# Altium schematic sheet ALL COMPLETED COMPONENTS.SchDoc
size A; SheetNumber: 1; SheetTotal: 1
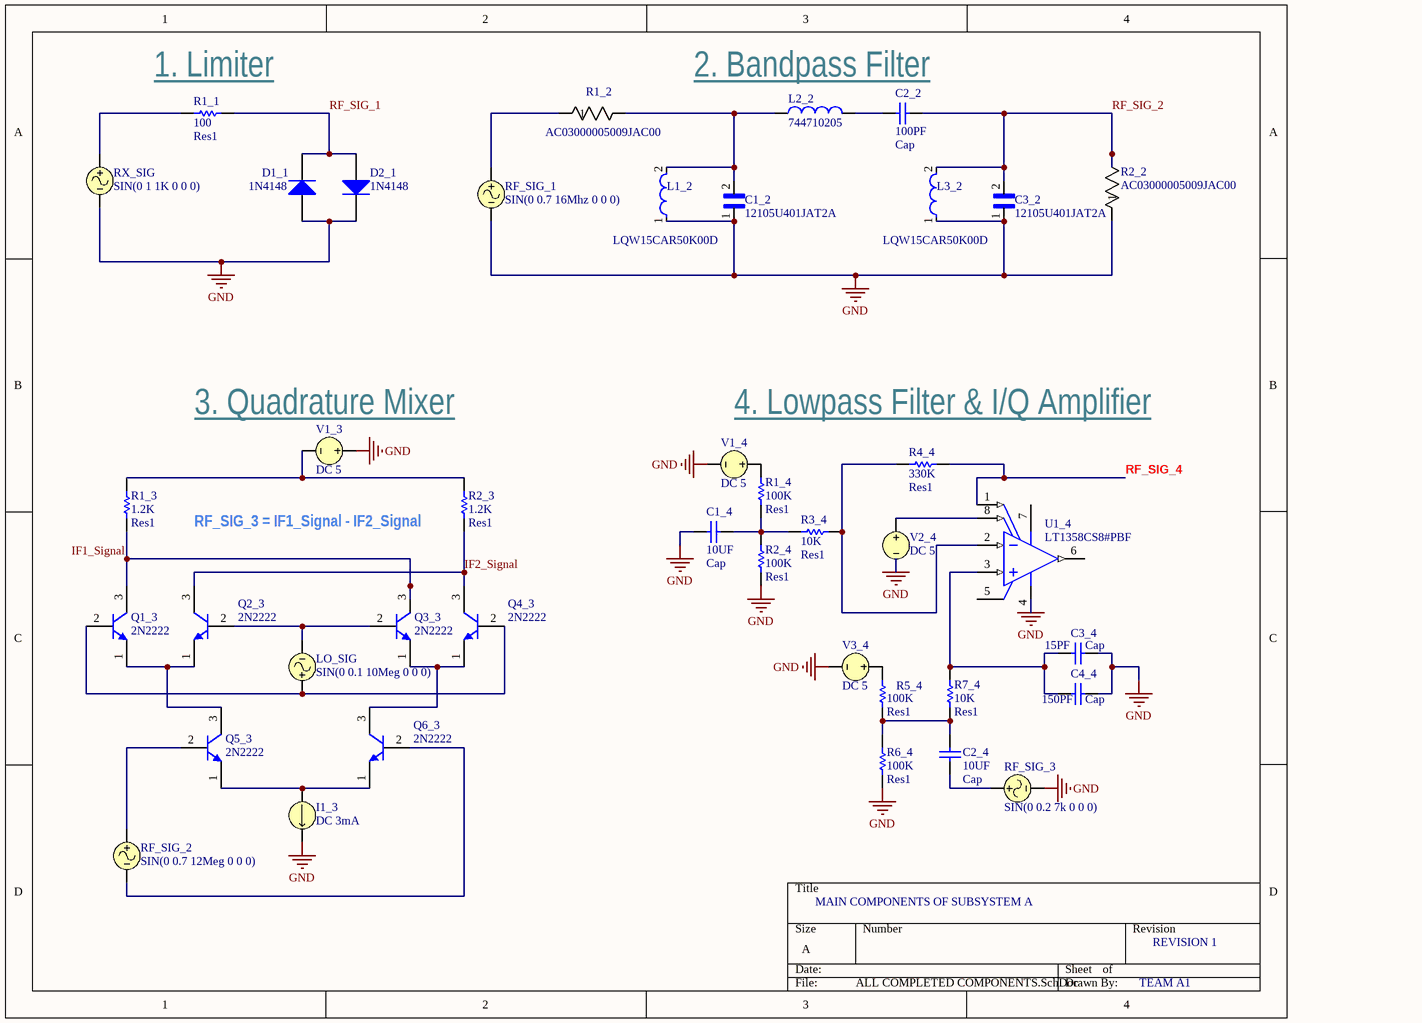
[diagram p0: ALL COMPLETED COMPONENTS.SchDoc]

## Parts
C1_2  12105U401JAT2A  [CAPC3224X140N]
C1_4  Cap  value 10UF  [RADIAL-0.1]
C2_2  Cap  value 100PF  [RADIAL-0.1]
C2_4  Cap  value 10UF  [RADIAL-0.1]
C3_2  12105U401JAT2A  [CAPC3224X140N]
C3_4  Cap  value 15PF  [RADIAL-0.1]
C4_4  Cap  value 150PF  [RADIAL-0.1]
D1_1  1N4148  [NXP-SOD27-2_V]
D2_1  1N4148  [NXP-SOD27-2_V]
I1_3  DC 3mA
L1_2  LQW15CAR50K00D  [FP-LQW15CA_00-MFG]
L2_2  744710205  [744710205]
L3_2  LQW15CAR50K00D  [FP-LQW15CA_00-MFG]
LO_SIG  SIN(0 0.1 10Meg 0 0 0)
Q1_3  2N2222  [MLTC-TO-18-3]
Q2_3  2N2222  [MLTC-TO-18-3]
Q3_3  2N2222  [MLTC-TO-18-3]
Q4_3  2N2222  [MLTC-TO-18-3]
Q5_3  2N2222  [MLTC-TO-18-3]
Q6_3  2N2222  [MLTC-TO-18-3]
R1_1  Res1  value 100  [AXIAL-0.1-RES]
R1_2  AC03000005009JAC00  [RES_AC03_VIS]
R1_3  Res1  value 1.2K  [AXIAL-0.1-RES]
R1_4  Res1  value 100K  [AXIAL-0.1-RES]
R2_2  AC03000005009JAC00  [RES_AC03_VIS]
R2_3  Res1  value 1.2K  [AXIAL-0.1-RES]
R2_4  Res1  value 100K  [AXIAL-0.1-RES]
R3_4  Res1  value 10K  [AXIAL-0.1-RES]
R4_4  Res1  value 330K  [AXIAL-0.1-RES]
R5_4  Res1  value 100K  [AXIAL-0.1-RES]
R6_4  Res1  value 100K  [AXIAL-0.1-RES]
R7_4  Res1  value 10K  [AXIAL-0.1-RES]
RF_SIG_1  SIN(0 0.7 16Mhz 0 0 0)
RF_SIG_2  SIN(0 0.7 12Meg 0 0 0)
RF_SIG_3  SIN(0 0.2 7k 0 0 0)
RX_SIG  SIN(0 1 1K 0 0 0)
U1_4  LT1358CS8#PBF  [LT-S8-8_M]
V1_3  DC 5
V1_4  DC 5
V2_4  DC 5
V3_4  DC 5

## Nets
GND: C1_2.1 C1_4.1 C3_2.1 C3_4.2 C4_4.1 D1_1.1(A) D2_1.2(K) I1_3.2 L1_2.1 L3_2.1 R2_2.1 R2_4.1 R6_4.1 RF_SIG_1.2 RF_SIG_3.2 RX_SIG.2 U1_4.4(V-) V1_3.1 V1_4.2 V2_4.2 V3_4.2
IF1_Signal: Q1_3.3(C) Q3_3.3(C) R1_3.1
IF2_Signal: Q2_3.3(C) Q4_3.3(C) R2_3.1
RF_SIG_1: D1_1.2(K) D2_1.1(A) R1_1.2
RF_SIG_2: C2_2.2 C3_2.2 L3_2.2 R2_2.2
RF_SIG_4: R4_4.2 U1_4.1(NULL)
NetC1_2_2: C1_2.2 L1_2.2 L2_2.1 R1_2.2
NetC1_4_2: C1_4.2 R1_4.1 R2_4.2 R3_4.1
NetC2_2_1: C2_2.1 L2_2.2
NetC2_4_1: C2_4.1 RF_SIG_3.1
NetC2_4_2: C2_4.2 R5_4.1 R6_4.2 R7_4.1
NetC3_4_1: C3_4.1 C4_4.2 R7_4.2 U1_4.3(+IN)
NetI1_3_1: I1_3.1 Q5_3.1(E) Q6_3.1(E)
NetLO_SIG_1: LO_SIG.1 Q1_3.2(B) Q4_3.2(B)
NetLO_SIG_2: LO_SIG.2 Q2_3.2(B) Q3_3.2(B)
NetQ1_3_1: Q1_3.1(E) Q2_3.1(E) Q5_3.3(C)
NetQ3_3_1: Q3_3.1(E) Q4_3.1(E) Q6_3.3(C)
NetQ5_3_2: Q5_3.2(B) RF_SIG_2.1
NetQ6_3_2: Q6_3.2(B) RF_SIG_2.2
NetR1_1_1: R1_1.1 RX_SIG.1
NetR1_2_1: R1_2.1 RF_SIG_1.1
NetR1_3_2: R1_3.2 R2_3.2 V1_3.2
NetR1_4_2: R1_4.2 V1_4.1
NetR3_4_2: R3_4.2 R4_4.1 U1_4.2(-IN)
NetR5_4_2: R5_4.2 V3_4.1
NetU1_4_8: U1_4.8(NULL) V2_4.1

Not connected (* = marked no-connect by the designer): U1_4 5(NC) 6(VOUT) 7(V+)

## Notes on the sheet
- (near R1_1) 1. Limiter
- 2. Bandpass Filter
- (near V1_3) 3. Quadrature Mixer
- 4. Lowpass Filter & I/Q Amplifier
- (near R2_3) RF_SIG_3 = IF1_Signal - IF2_Signal
- MAIN COMPONENTS OF SUBSYSTEM A
- REVISION 1
- TEAM A1

## Library data of the parts
C1_2 C3_2 = 12105U401JAT2A: CAP CER 400PF 50V 5% NP0 1210; Package: None; Price: None; Value: *; MP: 12105U401JAT2A; Availability: Unavailable
C1_4 C2_4 = CAP ALUM 10UF 20% 63V RADIAL: Capacitor; Manufacturer Part Number: ESK106M063AC3FA; Designator: C?; Voltage Rating: 63V; Published: 8-Jun-2000; LatestRevisionDate: 17-Jul-2002; LatestRevisionNote: Re-released for DXP Platform.; Publisher: Altium Limited
C2_2 = CAP CER 100PF 50V C0G/NP0 RADIAL: Capacitor; Manufacturer Part Number: K101K15C0GF53L2; Designator: C?; Voltage Rating: 50V; Published: 8-Jun-2000; LatestRevisionDate: 17-Jul-2002; LatestRevisionNote: Re-released for DXP Platform.; Publisher: Altium Limited
C3_4 = CAP CER 15PF 50V C0G/NP0 RADIAL: Capacitor; Manufacturer Part Number: K150J15C0GF5TL2; Designator: C?; Voltage Rating: 50V; Published: 8-Jun-2000; LatestRevisionDate: 17-Jul-2002; LatestRevisionNote: Re-released for DXP Platform.; Publisher: Altium Limited
C4_4 = CAP CER 150PF 50V C0G/NP0 RADIAL: Capacitor; Manufacturer Part Number: K151J15C0GF53L2; Designator: C?; Voltage Rating: 50V; Published: 8-Jun-2000; LatestRevisionDate: 17-Jul-2002; LatestRevisionNote: Re-released for DXP Platform.; Publisher: Altium Limited
D1_1 D2_1 = CMP-0648-00002-1: High-speed Diode, 100 V, 450 mA, 2-Pin SOD27, RoHS; Manufacturer: NXP Semiconductors; Configuration: Single; IR (VR: 20 V)=25 nA; IFRM: 450 mA; IFSM: 4 A Max.; Trr: 4 ns Max.; Cd: 4 pF Max.; VR: 100 V Max.; VF (IF: 10 mA)=1 V; IF: 200 mA Max.; ComponentLink1Description: Manufacturer URL; RoHS: TRUE; ComponentLink1URL: http://www.nxp.com/; ComponentLink3Description: Package Specification; DatasheetVersion: Aug-04; ComponentLink2Description: Datasheet; PackageVersion: Aug-04; PackageReference: SOD27; ComponentLink3URL: http://www.nxp.com/documents/data_sheet/1N4148_1N4448.pdf; Mounting Technology: Through Hole; ComponentLink2URL: http://www.nxp.com/documents/data_sheet/1N4148_1N4448.pdf; PartNumber: 1N4148; PackageDescription: 2-Pin Hermetically Sealed Glass Package, Axial Leaded, Dia 1.85 mm, Body Length 4.25 mm, Lead Spread 25.4 mm
I1_3 = ISRC: Current Source; Note: PCB Footprint - Not required; AC Magnitude: 0; Published: 8-Jun-2000; LatestRevisionDate: 17-Jul-2002; LatestRevisionNote: Re-released for DXP Platform.; PackageReference: Not Applicable; Publisher: Altium Limited; AC Phase: 0; Value: 3mA
L1_2 L3_2 = CMP-06042-016137-1: Wire Wound Ferrite Inductor for General Circuits 500nH ±10% 270mA 0.97Ω 0402 (1005); DC Resistance (DCR): 970mR; Test Frequency: 10MHz; Shielding: Unshielded; Self Resonant Frequency: 900MHz; RoHS Compliant: Yes; Case/Package: Nonstandard; Resistor Type: Wirewound; Height - Seated (Max): 0.026inch; Current Rating: 270mA; Width: 0.022inch; Tolerance: 10%; Min Operating Temperature: -40°C; Mount: Surface Mount; Packaging: Tape and Reel; Length: 0.04inch; Inductance: 500nH; Max Operating Temperature: 125°C; Core Material: Ferrite
L2_2 = CMP-0221-00023-2: 2 µH Unshielded Drum Core, Wirewound Inductor 5 A 6.5mOhm Radial, Horizontal Cylinder (Open); NexarPartId: 8917044; Lead Length: 9.7mm; Current Rating: 5A; Core Material: Ferrite; Frequency: 100MHz; Pin Length: 3mm; Test Frequency: 10kHz; Tolerance: 25%; Resistance: 6.5MΩ; Inductance: 2µH; RoHS: Compliant; Composition: Wirewound; Ambient Temperature Range Low: -40°C; Termination: Radial; Ambient Temperature Range High: 110°C; REACH SVHC: Unknown; Width: 9.6mm; Height: 14mm; Number of Pins: 2; Shielding: Unshielded; Length: 14mm; Lead Pitch: 9.6mm; Max Operating Temperature: 150°C; Inductance Tolerance: 25%; Mount: Through Hole; Case/Package: Radial; Max DC Current: 5A; Diameter: 4mm; Min Operating Temperature: -40°C; DC Resistance (DCR): 6.5mΩ; Self Resonant Frequency: 100MHz
LO_SIG = VSIN: Sinusoidal Voltage Source; Note: PCB Footprint - Not required; Offset: 0; Amplitude: 0.1; Published: 8-Jun-2000; LatestRevisionDate: 15-Nov-2004; LatestRevisionNote: Corrected Netlist.; PackageReference: Not Applicable; Publisher: Altium Limited; Frequency: 10Meg; Delay: 0; Damping Factor: 0; Phase: 0; DC Magnitude: 0; AC Magnitude: 0; AC Phase: 0
Q1_3 Q2_3 Q3_3 Q4_3 Q5_3 Q6_3 = CMP-2000-05237-1: Low Power Bipolar NPN Transistor, 30 V, -65 to 200 degC, 3-Pin TO-18, RoHS, Bulk; Manufacturer: Multicomp; Pin Configuration: a; No. of Pins: 3; No. of Transistors: 1; Collector Emitter Voltage Vces: 400mV; Current Ic Continuous a Max: 800mA; Power Dissipation Pd: 500mW; Collector Emitter Voltage V(br)ceo: 30V; Gain Bandwidth ft Typ: 250MHz; Voltage Vcbo: 60V; DC Current Gain hFE: 100; Full Power Rating Temperature: 25degC; Current Ic @ Vce Sat: 150mA; SVHC: NoSVHC(19-Dec-2012); Package Reference: TO-18-3; Package Description: 3-Pin Transistor Outline Package (TO-18), Dia 5.54 mm, Pitch Pitch 1.485mm; Datasheet URL: http://www.farnell.com/datasheets/1662272.pdf; Transistor Case Style: TO-18; Continuous Collector Current Ic Max: 800mA; Manufacturer URL: http://uk.farnell.com/b/multicomp; DC Collector Current: 800mA; Hfe Min: 100; Transistor Polarity: NPN; Power Dissipation Ptot Max: 500mW; Package / Case: TO-18; Datasheet Version: Rev. 1.1, 05/2012; Gain Bandwidth ft Min: 250MHz; Current Ic hFE: 150mA
R1_1 = RES 100 OHM 5% 1/4W AXIAL: Resistor; Manufacturer Part Number: CFR-25JB-52-100R; Designator: R?; Power Rating: 1/4W; Tolerance: 0.05; Published: 8-Jun-2000; LatestRevisionDate: 17-Jul-2002; LatestRevisionNote: Re-released for DXP Platform.; Publisher: Altium Limited
R1_2 R2_2 = CMP-00030-39746332-1: AC03000005009JAC00 Res Wirewound 50 Ohm 5% 3W -80ppm/°C to -10ppm/°C Conformal AXL Thru-Hole Ammo Pack; Voltage Rating: 12V; Lead Diameter: 800µm; Resistance: 50Ω; Number of Terminations: 2; Features: Flame Retardant Coating; Number of Pins: 2; Termination: Axial; Diameter: 4.8mm; Packaging: Tape & Box (TB); REACH SVHC: Unknown; Min Operating Temperature: -40°C; Contact Plating: Tin; Length: 13mm; Thickness: 4.8006mm; Power Rating: 3W; Schedule B: 8533210080, 8533210080; Temperature Coefficient: -80ppm/°C; Tolerance: 5%; RoHS: Compliant; Radiation Hardening: No; Voltage Rating (DC): 12V; Width: 4.8mm; Max Power Dissipation: 3W; Case/Package: Axial; Composition: Wirewound; Max Operating Temperature: 275°C; NexarPartId: 39746332
R1_3 R2_3 = RES 1.2K OHM 5% 1/4W AXIAL: Resistor; Manufacturer Part Number: CFR-25JB-52-1K2; Designator: R?; Power Rating: 1/4W; Tolerance: 0.05; Published: 8-Jun-2000; LatestRevisionDate: 17-Jul-2002; LatestRevisionNote: Re-released for DXP Platform.; Publisher: Altium Limited
R1_4 R2_4 R5_4 R6_4 = RES 100K OHM 5% 1/4W AXIAL: Resistor; Manufacturer Part Number: CFR-25JB-52-100K; Designator: R?; Power Rating: 1/4W; Tolerance: 0.05; Published: 8-Jun-2000; LatestRevisionDate: 17-Jul-2002; LatestRevisionNote: Re-released for DXP Platform.; Publisher: Altium Limited
R3_4 R7_4 = RES 10K OHM 5% 1/4W AXIAL: Resistor; Manufacturer Part Number: CFR-25JB-52-10K; Designator: R?; Power Rating: 1/4W; Tolerance: 0.05; Published: 8-Jun-2000; LatestRevisionDate: 17-Jul-2002; LatestRevisionNote: Re-released for DXP Platform.; Publisher: Altium Limited
R4_4 = RES 330K OHM 5% 1/4W AXIAL: Resistor; Manufacturer Part Number: CFR-25JB-52-330K; Designator: R?; Power Rating: 1/4W; Tolerance: 0.05; Published: 8-Jun-2000; LatestRevisionDate: 17-Jul-2002; LatestRevisionNote: Re-released for DXP Platform.; Publisher: Altium Limited
RF_SIG_1 = VSIN: Sinusoidal Voltage Source; Note: PCB Footprint - Not required; Offset: 0; Amplitude: 0.7; AC Magnitude: 1; Published: 8-Jun-2000; LatestRevisionDate: 15-Nov-2004; LatestRevisionNote: Corrected Netlist.; PackageReference: Not Applicable; Publisher: Altium Limited; Frequency: 16Mhz; Delay: 0; Damping Factor: 0; Phase: 0; DC Magnitude: 0; AC Phase: 0
RF_SIG_2 = VSIN: Sinusoidal Voltage Source; Note: PCB Footprint - Not required; Offset: 0; Amplitude: 0.7; Published: 8-Jun-2000; LatestRevisionDate: 15-Nov-2004; LatestRevisionNote: Corrected Netlist.; PackageReference: Not Applicable; Publisher: Altium Limited; Frequency: 12Meg; Delay: 0; Damping Factor: 0; Phase: 0; DC Magnitude: 0; AC Magnitude: 0; AC Phase: 0
RF_SIG_3 = VSIN: Sinusoidal Voltage Source; Note: PCB Footprint - Not required; Offset: 0; Amplitude: 0.2; AC Magnitude: 1; Published: 8-Jun-2000; LatestRevisionDate: 15-Nov-2004; LatestRevisionNote: Corrected Netlist.; PackageReference: Not Applicable; Publisher: Altium Limited; Frequency: 7k; Delay: 0; Damping Factor: 0; Phase: 0; DC Magnitude: 0; AC Phase: 0
RX_SIG = VSIN: Sinusoidal Voltage Source; Note: PCB Footprint - Not required; Offset: 0; Amplitude: 1; Published: 8-Jun-2000; LatestRevisionDate: 15-Nov-2004; LatestRevisionNote: Corrected Netlist.; PackageReference: Not Applicable; Publisher: Altium Limited; Frequency: 1K; Delay: 0; Damping Factor: 0; Phase: 0; DC Magnitude: 0; AC Magnitude: 1; AC Phase: 0
U1_4 = CMP-0359-02713-2: Dual Channel, High Speed Precision Operational Amplifier, 25 MHz Typical GBW, 600 V/us Typical SR, 5 to 36 V, 8-Pin SOIC (S8-8), Commerical, Pb-Free; Manufacturer: Linear Technology; Linear Technology Part Number: LT1358; Vos (mV) Typical: 0.2; Vs Min (V): 5; Channels (#): 2; SR (V/us) Typical: 600; GBW (MHz) Typical: 25; Vs Max (V): 36; Mounting Technology: Surface Mount; ComponentLink3URL: http://cds.linear.com/docs/en/packaging/05081610_G_SO8.pdf; ComponentLink2URL: http://cds.linear.com/docs/en/datasheet/135859fb.pdf; Is (mA) Typical: 2; DatasheetVersion: Rev. B; ComponentLink1URL: http://www.linear.com/; Type: VFB; RoHS: Pb-Free; ComponentLink3Description: Package Specification; ComponentLink1Description: Manufacturer URL; RevisionNote: URLs updated; PackageReference: LT-S8-8; PackageVersion: Rev G; PartNumber: LT1358CS8#PBF; PackageDescription: 8-Pin Plastic Small Outline, Body 4.9 x 3.9 mm, Pitch 1.27 mm; ComponentLink2Description: Datasheet
V1_3 = VSRC: Voltage Source; Note: PCB Footprint - Not required; AC Magnitude: 0; Value: 5; Published: 8-Jun-2000; LatestRevisionDate: 17-Jul-2002; LatestRevisionNote: Re-released for DXP Platform.; PackageReference: Not Applicable; Publisher: Altium Limited; AC Phase: 0
V1_4 V2_4 V3_4 = VSRC: Voltage Source; Note: PCB Footprint - Not required; AC Magnitude: 1; AC Phase: 0; Value: 5; Published: 8-Jun-2000; LatestRevisionDate: 17-Jul-2002; LatestRevisionNote: Re-released for DXP Platform.; PackageReference: Not Applicable; Publisher: Altium Limited